# Altium schematic sheet 13.WDT.SchDoc
size A4; CheckedBy: YPC; DocumentNumber: 13; Revision: V1.00; SheetNumber: 13; SheetTotal: 18; SheetName: WDT; SheetDescribe: SheetDescribe; Designer: JOW; DesignDate: 2025-04-10; CheckedData: 2025-04-10
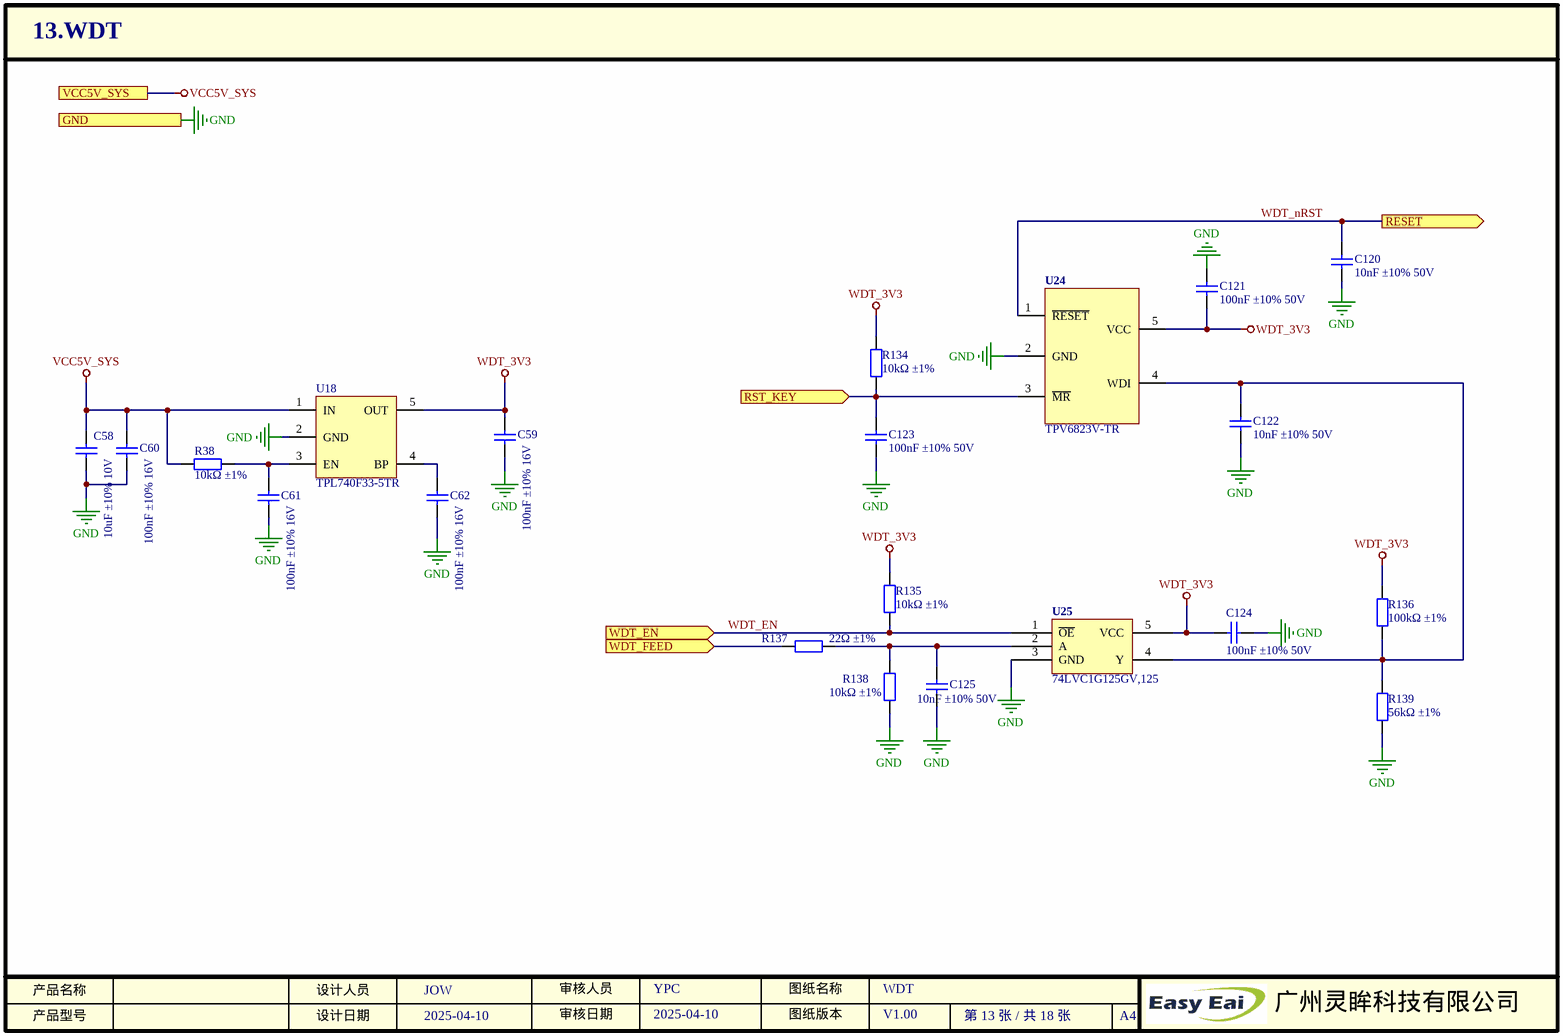
[diagram p0: 13.WDT.SchDoc]

## Parts
C58  描述: 10uF ±10% 10V  [0603_C]  (hidden comment: CL10A106KP8NNNC)
C59  描述: 100nF ±10% 16V  [0402_C]  (hidden comment: CL05B104KO5NNNC)
C60  描述: 100nF ±10% 16V  [0402_C]  (hidden comment: CL05B104KO5NNNC)
C61  描述: 100nF ±10% 16V  [0402_C]  (hidden comment: CL05B104KO5NNNC)
C62  描述: 100nF ±10% 16V  [0402_C]  (hidden comment: CL05B104KO5NNNC)  (no BOM)
C120  描述: 10nF ±10% 50V  [0402_C]  (hidden comment: CL05B103KB5NNNC)
C121  描述: 100nF ±10% 50V  [0402_C]  (hidden comment: GRM155R71H104KE14D)
C122  描述: 10nF ±10% 50V  [0402_C]  (hidden comment: CL05B103KB5NNNC)
C123  描述: 100nF ±10% 50V  [0402_C]  (hidden comment: GRM155R71H104KE14D)
C124  描述: 100nF ±10% 50V  [0402_C]  (hidden comment: GRM155R71H104KE14D)
C125  描述: 10nF ±10% 50V  [0402_C]  (hidden comment: CL05B103KB5NNNC)
R38  描述: 10kΩ ±1%  [0402_R]  (hidden comment: 0402WGF1002TCE)
R134  描述: 10kΩ ±1%  [0402_R]  (hidden comment: 0402WGF1002TCE)
R135  描述: 10kΩ ±1%  [0402_R]  (hidden comment: 0402WGF1002TCE)
R136  描述: 100kΩ ±1%  [0402_R]  (hidden comment: 0402WGF1003TCE)
R137  描述: 22Ω ±1%  [0402_R]  (hidden comment: 0402WGF220JTCE)
R138  描述: 10kΩ ±1%  [0402_R]  (hidden comment: 0402WGF1002TCE)
R139  描述: 56kΩ ±1%  [0402_R]  (hidden comment: 0402WGF5602TCE)
U18  TPL740F33-5TR  [SOT-23-5]
U24  TPV6823V-TR  [SOT-23-5]
U25  74LVC1G125GV,125  [SOT-23-5]

## Ports
GND, RESET (out), RST_KEY (in), VCC5V_SYS, WDT_EN (in), WDT_FEED (in)

## Nets
GND: C58.1 C59.1 C60.1 C61.1 C62.1 C120.1 C121.2 C122.1 C123.2 C124.1 C125.1 R138.1 R139.1 U18.2(GND) U24.2(GND) U25.3(GND) ; port GND
VCC5V_SYS: C58.2 C60.2 R38.1 U18.1(IN) ; port VCC5V_SYS
WDT_3V3: C59.2 C121.1 C124.2 R134.2 R135.2 R136.2 U18.5(OUT) U24.5(VCC) U25.5(VCC)
RST_KEY: C123.1 R134.1 U24.3(~{MR}) ; port RST_KEY
WDT_EN: R135.1 U25.1(~{OE}) ; port WDT_EN
WDT_FEED: R137.1 ; port WDT_FEED
WDT_nRST: C120.2 U24.1(~{RESET}) ; port RESET
NetC61_2: C61.2 R38.2 U18.3(EN)
NetC62_2: C62.2 U18.4(BP)
NetC122_2: C122.2 R136.1 R139.2 U24.4(WDI) U25.4(Y)
NetC125_2: C125.2 R137.2 R138.2 U25.2(A)

## Notes on the sheet
- 产品名称
- 产品型号
- 设计人员
- 设计日期
- 审核人员
- 审核日期
- 图纸版本
- 图纸名称
- A4
- 广州灵眸科技有限公司

## Library data of the parts
C58 = 0603 10uF ±10% 10V: SPZL000260; 名称: 贴片电容; 厂商: SAMSUNG(三星); 封装: 0603; 工作温度: -55~85℃; 贴片和直插: SMD; 型号: CL10A106KP8NNNC; SuppliersPartNumber: C19702; 商品编号: SPZL000260
C59-C62 = 0402 100nF ±10% 16V: SPZL000259; 名称: 贴片电容; 厂商: SAMSUNG(三星); 封装: 0402; 工作温度: -55~125℃; 贴片和直插: SMD; 型号: CL05B104KO5NNNC; SuppliersPartNumber: C1525; 商品编号: SPZL000259
C120 C122 C125 = 0402 10nF ±10% 50V: SPZL000342; 名称: 贴片电容; 厂商: SAMSUNG(三星); 封装: 0402; 工作温度: -55~125℃; 贴片和直插: SMD; 型号: CL05B103KB5NNNC; SuppliersPartNumber: C15195; 商品编号: SPZL000342
C121 C123 C124 = 0402 100nF ±10% 50V: SPZL001162; 名称: 贴片电容; 厂商: muRata(村田); 封装: 0402; 工作温度: -55~125℃; 贴片和直插: SMD; 型号: GRM155R71H104KE14D; SuppliersPartNumber: C77020; 商品编号: SPZL001162
R38 R134 R135 R138 = 0402 10kΩ ±1%: SPZL000271; 封装: 0402; 厂商: UNI-ROYAL(厚声); 贴片和直插: SMD; 名称: 电阻; 工作温度: -55~155℃; SuppliersPartNumber: C25744; 型号: 0402WGF1002TCE; 商品编号: SPZL000271
R136 = 0402 100kΩ ±1%: SPZL000282; 封装: 0402; 厂商: UNI-ROYAL(厚声); 贴片和直插: SMD; 名称: 电阻; 工作温度: -55~155℃; SuppliersPartNumber: C25741; 型号: 0402WGF1003TCE; 商品编号: SPZL000282
R137 = 0402 22Ω ±1%: SPZL000279; 封装: 0402; 厂商: UNI-ROYAL(厚声); 贴片和直插: SMD; 名称: 电阻; 工作温度: -55~155℃; SuppliersPartNumber: C25092; 型号: 0402WGF220JTCE; 商品编号: SPZL000279
R139 = 0402 56kΩ ±1%: SPZL000395; 封装: 0402; 厂商: UNI-ROYAL(厚声); 贴片和直插: SMD; 名称: 电阻; 工作温度: -55~155℃; SuppliersPartNumber: C25796; 型号: 0402WGF5602TCE; 商品编号: SPZL000395
U18 = TPL740F33-5TR: SPZL000784; 名称: 电源IC; 厂商: 3PEAK; 贴片和直插: SMD; 描述: LDO; 工作温度: -40~85℃; 封装: SOT-23-5; SuppliersPartNumber: *; 商品编号: SPZL000784; 型号: TPL740F33-5TR
U24 = TPV6823V-TR: SPZL000751; 名称: IC; 封装: SOT23-5; 厂商: 3PEAK; 贴片和直插: SMD; 描述: 1.8V看门狗芯片; 工作温度: -40~125℃; 商品编号: SPZL000751; 型号: TPV6823V-TR
U25 = 74LVC1G125GV,125: SPZL000608; 名称: IC; 封装: SOT-753; 厂商: Nexperia(安世); 贴片和直插: SMD; 描述: 缓冲器; 工作温度: -40~85℃; SuppliersPartNumber: C12518; 商品编号: SPZL000608; 型号: 74LVC1G125GV,125